# EAGLE schematic Eagle_Power (EAGLE 6.6.0)
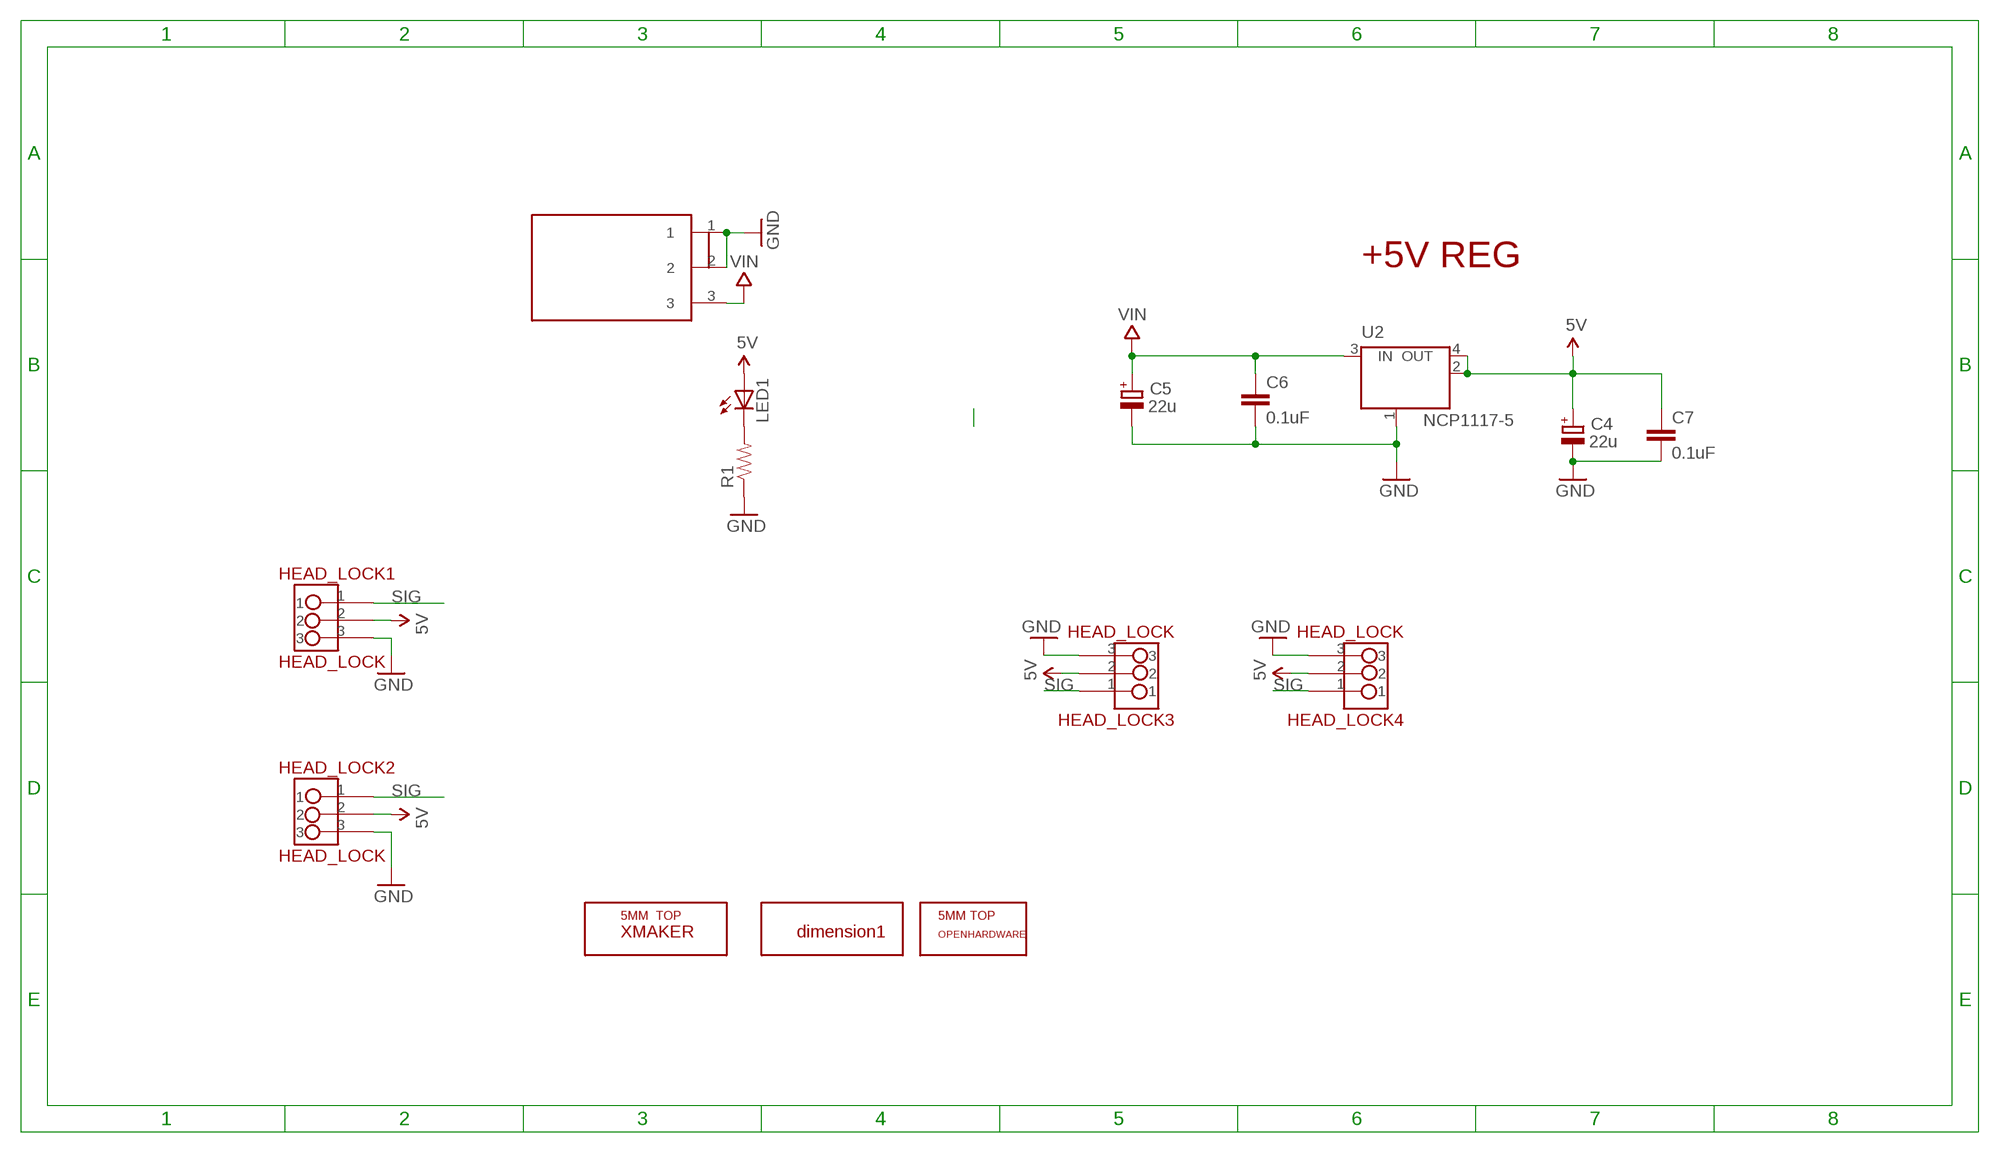
[diagram p0: schematic, sheet 1]

## Parts
C4  22u  CPOL-EUSMCB  [SMC_B]
C5  22u  CPOL-EUSMCB  [SMC_B]
C6  0.1uF  0.1UF-25V(+80/-20%)(0603)  [0603-CAP]
C7  0.1uF  0.1UF-25V(+80/-20%)(0603)  [0603-CAP]
HEAD_LOCK1  HEAD_LOCK  [HEAD_LOCK]
HEAD_LOCK2  HEAD_LOCK  [HEAD_LOCK]
HEAD_LOCK3  HEAD_LOCK  [HEAD_LOCK]
HEAD_LOCK4  HEAD_LOCK  [HEAD_LOCK]
LED1  LEDSML0603  [SML0603]
R1  RESISTOR0603-RES  [0603-RES]
U2  NCP1117-5  LINEAR_MC33269ST  [LINEAR_SOT223]
U$2  OPENHARDWARE_5MM_TOP  [OPENSOURCE_5MM_TOP]
U$4  DIMENSION1  [DIMENSION1]
U$5  DC5.52.1MM  [DC5.5*2.1MM]
U$6  XMAKERLOGO_5MM_TOP  [XMAKERLOGO_5MM_TOP]

## Nets
5V: C4.+ C7.1 HEAD_LOCK1.2 HEAD_LOCK2.2 HEAD_LOCK3.2 HEAD_LOCK4.2 LED1.A U2.2(OUT) U2.4(OUT)
GND: C4.- C5.- C6.2 C7.2 HEAD_LOCK1.3 HEAD_LOCK2.3 HEAD_LOCK3.3 HEAD_LOCK4.3 R1.1 U2.1(GND/ADJ) U$5.1 U$5.2
N$1: LED1.C R1.2
SIG: HEAD_LOCK1.1 HEAD_LOCK2.1 HEAD_LOCK3.1 HEAD_LOCK4.1
VIN: C5.+ C6.1 U2.3(IN) U$5.3

## Notes on the sheet
- +5V REG

## Library data of the parts
C4 C5 = rcl:CPOL-EU: POLARIZED CAPACITOR, European symbol
C6 C7 = SparkFun-Capacitors:0.1UF-25V(+80/-20%)(0603): CAP-00810 Ceramic Standard decoupling cap; PROD_ID: CAP-00810
HEAD_LOCK1-HEAD_LOCK4 = Xmaker_yuhui:HEAD_LOCK
LED1 = led:LED: LED OSRAM: - CHIPLED LG R971, LG N971, LY N971, LG Q971, LY Q971, LO R971, LY R971 LH N974, LH R974 LS Q976, LO Q976, LY Q976 LO Q996 - Hyper CHIPLED LW Q18S LB Q993, LB Q99A, LB R99A - SideLED LS A670, LO A670, LY A670, LG A670, LP A670 LB A673, LV A673, LT A673, LW A673 LH A674 LY A675 LS A676, LA A676, LO A676, LY A676, LW A676 LS A679, LY A679, LG A679 - Hyper Micro SIDELED® LS Y876, LA Y876, LO Y876, LY Y876 LT Y87S - SmartLED LW L88C, LW L88S LB L89C, LB L89S, LG L890 LS L89K, LO L89K, LY L89K LS L896, LA L896, LO L896, LY L896 - TOPLED LS T670, LO T670, LY T670, LG T670, LP T670 LSG T670, LSP T670, LSY T670, LOP T670, LYG T670 LG T671, LOG T671, LSG T671 LB T673, LV T673, LT T673, LW T673 LH T674 LS T676, LA T676, LO T676, LY T676, LB T676, LH T676, LSB T676, LW T676 LB T67C, LV T67C, LT T67C, LS T67K, LO T67K, LY T67K, LW E67C LS E67B, LA E67B, LO E67B, LY E67B, LB E67C, LV E67C, LT E67C LW T67C LS T679, LY T679, LG T679 LS T770, LO T770, LY T770, LG T770, LP T770 LB T773, LV T773, LT T773, LW T773 LH T774 LS E675, LA E675, LY E675, LS T675 LS T776, LA T776, LO T776, LY T776, LB T776 LHGB T686 LT T68C, LB T68C - Hyper Mini TOPLED® LB M676 - Mini TOPLED Santana® LG M470 LS M47K, LO M47K, LY M47K Source: http://www.osram.convergy.de LUXEON: - LUMILED® LXK2-PW12-R00, LXK2-PW12-S00, LXK2-PW14-U00, LXK2-PW14-V00 LXK2-PM12-R00, LXK2-PM12-S00, LXK2-PM14-U00 LXK2-PE12-Q00, LXK2-PE12-R00, LXK2-PE12-S00, LXK2-PE14-T00, LXK2-PE14-U00 LXK2-PB12-K00, LXK2-PB12-L00, LXK2-PB12-M00, LXK2-PB14-N00, LXK2-PB14-P00, LXK2-PB14-Q00 LXK2-PR12-L00, LXK2-PR12-M00, LXK2-PR14-Q00, LXK2-PR14-R00 LXK2-PD12-Q00, LXK2-PD12-R00, LXK2-PD12-S00 LXK2-PH12-R00, LXK2-PH12-S00 LXK2-PL12-P00, LXK2-PL12-Q00, LXK2-PL12-R00 Source: www.luxeon.com KINGBRIGHT: KA-3528ASYC Source: www.kingbright.com
R1 = SparkFun-Passives:RESISTOR: Resistor Basic schematic elements and footprints for 0603, 1206, and PTH resistors.
U2 = SmartPrj:LINEAR_MC33269ST*: Adjustable Output Low Dropout Voltage Regulator 800 mA Source: http://www.onsemi.com/pub/Collateral/MC33269-D.PDF
U$2 = Xmaker_yuhui:OPENHARDWARE_5MM_TOP
U$4 = Xmaker_yuhui:DIMENSION1
U$5 = Xmaker_yuhui:DC5.5*2.1MM
U$6 = Xmaker_yuhui:XMAKERLOGO_5MM_TOP

## Net classes
0 default: width 0.254 mm, drill 0.61 mm, clearance 0.203 mm